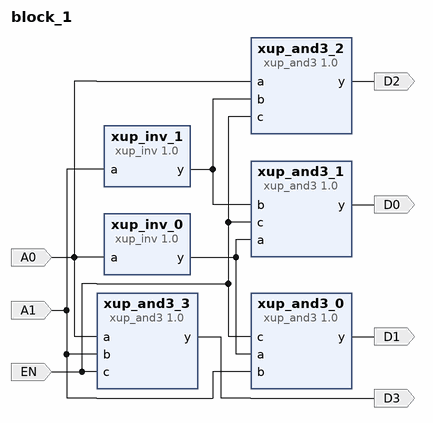
[diagram p0: block diagram of the top level]
# Vivado block design block_1, xc7a35tcpg236-1, Vivado 2023.1
create_bd_design block_1

create_bd_port -dir I EN
create_bd_port -dir I A0
create_bd_port -dir I A1
create_bd_port -dir O D0
create_bd_port -dir O D1
create_bd_port -dir O D2
create_bd_port -dir O D3

create_bd_cell -type ip -vlnv xilinx.com:XUP:xup_and3:1.0 xup_and3_0
create_bd_cell -type ip -vlnv xilinx.com:XUP:xup_and3:1.0 xup_and3_1
create_bd_cell -type ip -vlnv xilinx.com:XUP:xup_and3:1.0 xup_and3_2
create_bd_cell -type ip -vlnv xilinx.com:XUP:xup_and3:1.0 xup_and3_3
create_bd_cell -type ip -vlnv xilinx.com:XUP:xup_inv:1.0 xup_inv_0
create_bd_cell -type ip -vlnv xilinx.com:XUP:xup_inv:1.0 xup_inv_1

# ---- connections ----

connect_bd_net -net A0_1 [get_bd_ports A0] [get_bd_pins xup_inv_0/a] [get_bd_pins xup_and3_2/a] [get_bd_pins xup_and3_3/a]
connect_bd_net -net A1_1 [get_bd_ports A1] [get_bd_pins xup_inv_1/a] [get_bd_pins xup_and3_0/b] [get_bd_pins xup_and3_3/b]
connect_bd_net [get_bd_ports EN] [get_bd_pins xup_and3_1/c] [get_bd_pins xup_and3_0/c] [get_bd_pins xup_and3_2/c] [get_bd_pins xup_and3_3/c]
connect_bd_net [get_bd_pins xup_and3_0/y] [get_bd_ports D1]
connect_bd_net [get_bd_pins xup_and3_1/y] [get_bd_ports D0]
connect_bd_net [get_bd_pins xup_and3_2/y] [get_bd_ports D2]
connect_bd_net [get_bd_pins xup_and3_3/y] [get_bd_ports D3]
connect_bd_net [get_bd_pins xup_inv_0/y] [get_bd_pins xup_and3_1/a] [get_bd_pins xup_and3_0/a]
connect_bd_net [get_bd_pins xup_inv_1/y] [get_bd_pins xup_and3_1/b] [get_bd_pins xup_and3_2/b]

validate_bd_design
save_bd_design
